# Altium schematic sheet 07-XORStatusLed.SchDoc
size A4
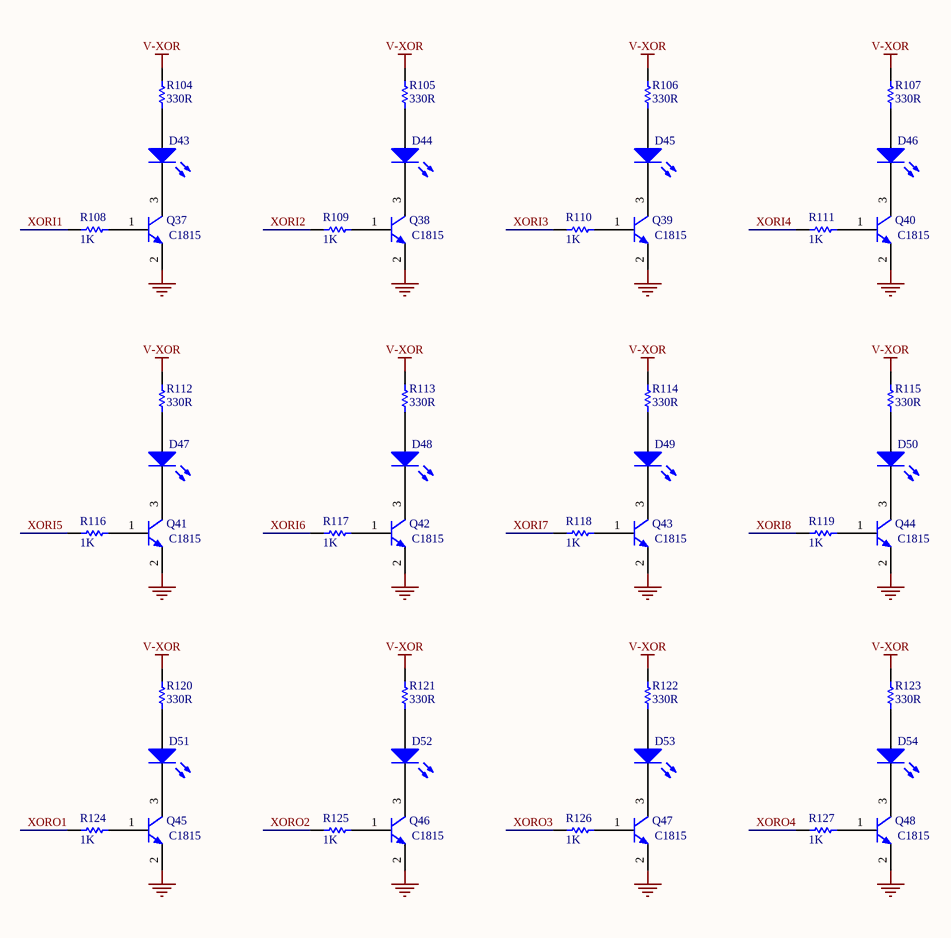
[diagram p0: 07-XORStatusLed.SchDoc]

## Parts
D43  LED  [LED-3528]  (value not drawn)
D44  LED  [LED-3528]  (value not drawn)
D45  LED  [LED-3528]  (value not drawn)
D46  LED  [LED-3528]  (value not drawn)
D47  LED  [LED-3528]  (value not drawn)
D48  LED  [LED-3528]  (value not drawn)
D49  LED  [LED-3528]  (value not drawn)
D50  LED  [LED-3528]  (value not drawn)
D51  LED  [LED-3528]  (value not drawn)
D52  LED  [LED-3528]  (value not drawn)
D53  LED  [LED-3528]  (value not drawn)
D54  LED  [LED-3528]  (value not drawn)
Q37  value C1815  [SOT23-321]  (hidden comment: C1815-SMD)
Q38  value C1815  [SOT23-321]  (hidden comment: C1815-SMD)
Q39  value C1815  [SOT23-321]  (hidden comment: C1815-SMD)
Q40  value C1815  [SOT23-321]  (hidden comment: C1815-SMD)
Q41  value C1815  [SOT23-321]  (hidden comment: C1815-SMD)
Q42  value C1815  [SOT23-321]  (hidden comment: C1815-SMD)
Q43  value C1815  [SOT23-321]  (hidden comment: C1815-SMD)
Q44  value C1815  [SOT23-321]  (hidden comment: C1815-SMD)
Q45  value C1815  [SOT23-321]  (hidden comment: C1815-SMD)
Q46  value C1815  [SOT23-321]  (hidden comment: C1815-SMD)
Q47  value C1815  [SOT23-321]  (hidden comment: C1815-SMD)
Q48  value C1815  [SOT23-321]  (hidden comment: C1815-SMD)
R104  330R  [R-0805]
R105  330R  [R-0805]
R106  330R  [R-0805]
R107  330R  [R-0805]
R108  1K  [R-0805]
R109  1K  [R-0805]
R110  1K  [R-0805]
R111  1K  [R-0805]
R112  330R  [R-0805]
R113  330R  [R-0805]
R114  330R  [R-0805]
R115  330R  [R-0805]
R116  1K  [R-0805]
R117  1K  [R-0805]
R118  1K  [R-0805]
R119  1K  [R-0805]
R120  330R  [R-0805]
R121  330R  [R-0805]
R122  330R  [R-0805]
R123  330R  [R-0805]
R124  1K  [R-0805]
R125  1K  [R-0805]
R126  1K  [R-0805]
R127  1K  [R-0805]

## Nets
GND: Q37.2(E) Q38.2(E) Q39.2(E) Q40.2(E) Q41.2(E) Q42.2(E) Q43.2(E) Q44.2(E) Q45.2(E) Q46.2(E) Q47.2(E) Q48.2(E)
V-XOR: R104.2 R105.2 R106.2 R107.2 R112.2 R113.2 R114.2 R115.2 R120.2 R121.2 R122.2 R123.2
XORI1: R108.2
XORI2: R109.2
XORI3: R110.2
XORI4: R111.2
XORI5: R116.2
XORI6: R117.2
XORI7: R118.2
XORI8: R119.2
XORO1: R124.2
XORO2: R125.2
XORO3: R126.2
XORO4: R127.2
NetD43_1: D43.1(A) R104.1
NetD43_2: D43.2(K) Q37.3(C)
NetD44_1: D44.1(A) R105.1
NetD44_2: D44.2(K) Q38.3(C)
NetD45_1: D45.1(A) R106.1
NetD45_2: D45.2(K) Q39.3(C)
NetD46_1: D46.1(A) R107.1
NetD46_2: D46.2(K) Q40.3(C)
NetD47_1: D47.1(A) R112.1
NetD47_2: D47.2(K) Q41.3(C)
NetD48_1: D48.1(A) R113.1
NetD48_2: D48.2(K) Q42.3(C)
NetD49_1: D49.1(A) R114.1
NetD49_2: D49.2(K) Q43.3(C)
NetD50_1: D50.1(A) R115.1
NetD50_2: D50.2(K) Q44.3(C)
NetD51_1: D51.1(A) R120.1
NetD51_2: D51.2(K) Q45.3(C)
NetD52_1: D52.1(A) R121.1
NetD52_2: D52.2(K) Q46.3(C)
NetD53_1: D53.1(A) R122.1
NetD53_2: D53.2(K) Q47.3(C)
NetD54_1: D54.1(A) R123.1
NetD54_2: D54.2(K) Q48.3(C)
NetQ37_1: Q37.1(B) R108.1
NetQ38_1: Q38.1(B) R109.1
NetQ39_1: Q39.1(B) R110.1
NetQ40_1: Q40.1(B) R111.1
NetQ41_1: Q41.1(B) R116.1
NetQ42_1: Q42.1(B) R117.1
NetQ43_1: Q43.1(B) R118.1
NetQ44_1: Q44.1(B) R119.1
NetQ45_1: Q45.1(B) R124.1
NetQ46_1: Q46.1(B) R125.1
NetQ47_1: Q47.1(B) R126.1
NetQ48_1: Q48.1(B) R127.1

## Library data of the parts
D43-D54 = LED2: Typical RED, GREEN, YELLOW, AMBER GaAs LED; Published: 8-Jun-2000; LatestRevisionDate: 17-Jul-2002; LatestRevisionNote: Re-released for DXP Platform.; PackageVersion: Feb-2002; PackageReference: 3.2X1.6X1.1; Publisher: Altium Limited; PackageDescription: SM LED; 2 Flat Leads
Q37-Q48 = NPN: NPN Bipolar Transistor; Published: 8-Jun-2000; LatestRevisionDate: 17-Jul-2002; LatestRevisionNote: Re-released for DXP Platform.; PackageReference: TO-226-AA; PackageDescription: TO, Flat Index; 3 In-Line, Axial Leads; Body Dia. 4.8mm; Leads 0.55 x 0.51 mm (max); Code_JEDEC: TO-226-AA
R104-R127 = Res1: Resistor; Published: 8-Jun-2000; LatestRevisionDate: 17-Jul-2002; LatestRevisionNote: Re-released for DXP Platform.; PackageReference: AXIAL-0.3; Publisher: Altium Limited; PackageDescription: Axial Device, Thru-Hole; 2 Leads; 0.3 in Pin Spacing
  R104-R107 R112-R115 R120-R123: Value: 330R
  R108-R111 R116-R119 R124-R127: Value: 1K